# Altium project LC_MATCH_0.PrjPcb
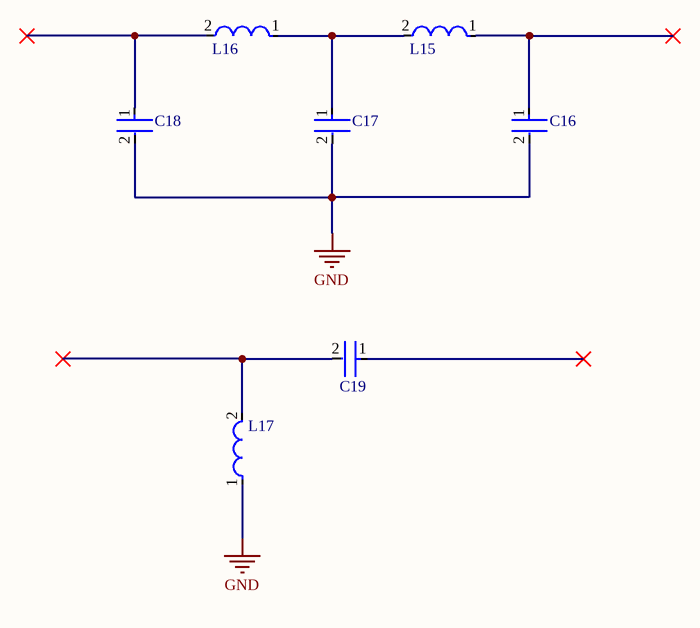
[diagram p0: LC_MATCH_0.SchDoc]
1 sheet, 7 parts. Net scope: global (net labels, ports and power ports of the same name join across sheets).
Board file: LC_MATCH_0.PcbDoc

## Sheet LC_MATCH_0.SchDoc
size A

### Parts
C16  GQM2195C2E300GB12D  [FP-GRM21A-0_2-MFG]  (value not drawn)
C17  GQM2195C2E430GB12D  [FP-GRM21A-0_2-MFG]  (value not drawn)
C18  GQM2195C2E300GB12D  [FP-GRM21A-0_2-MFG]  (value not drawn)
C19  GRM21A5C2J120FWA1D  [FP-GRM21A-0_2-MFG]  (value not drawn)
L15  LQW2BAS56NG00L  [FP-LQW2BAN_00-MFG]  (value not drawn)
L16  LQW2BAS56NG00L  [FP-LQW2BAN_00-MFG]  (value not drawn)
L17  LQW2UAS56NF00L  [FP-LQW2UAS_00-MFG]  (value not drawn)

### Nets
GND: C16.2 C17.2 C18.2 L17.1
NetC16_1: C16.1 L15.1
NetC17_1: C17.1 L15.2 L16.1
NetC18_1: C18.1 L16.2
NetC19_2: C19.2 L17.2

Not connected (* = marked no-connect by the designer): C19 1*

### Library data of the parts
C16-C19 = CMP-06035-012030-1: Chip Multilayer Ceramic Capacitors for General Purpose, 0805, 1000pF, C0G, 30ppm/°C, 1%, 250V
L15 L16 = CMP-06042-001883-1: Wire Wound RF Inductor 56nH ±2% 500mA 0.34Ω 0805 (2015); Shielding: Unshielded; DC Resistance (DCR): 340mR; Test Frequency: 200MHz; Self Resonant Frequency: 1.6GHz; Width: 0.06inch; Min Operating Temperature: -40°C; Inductance: 56nH; Mount: Surface Mount; Packaging: Tape and Reel; Resistor Type: Wirewound; Max Operating Temperature: 85°C; Package Quantity: 2000; Current Rating: 500mA; Case/Package: 0805; Length: 0.082inch; Height - Seated (Max): 0.061inch; Tolerance: 2%
L17 = CMP-06042-009211-1: Wire Wound RF Inductor 56nH ±1% 1000mA 0.18Ω 1008 (2520)